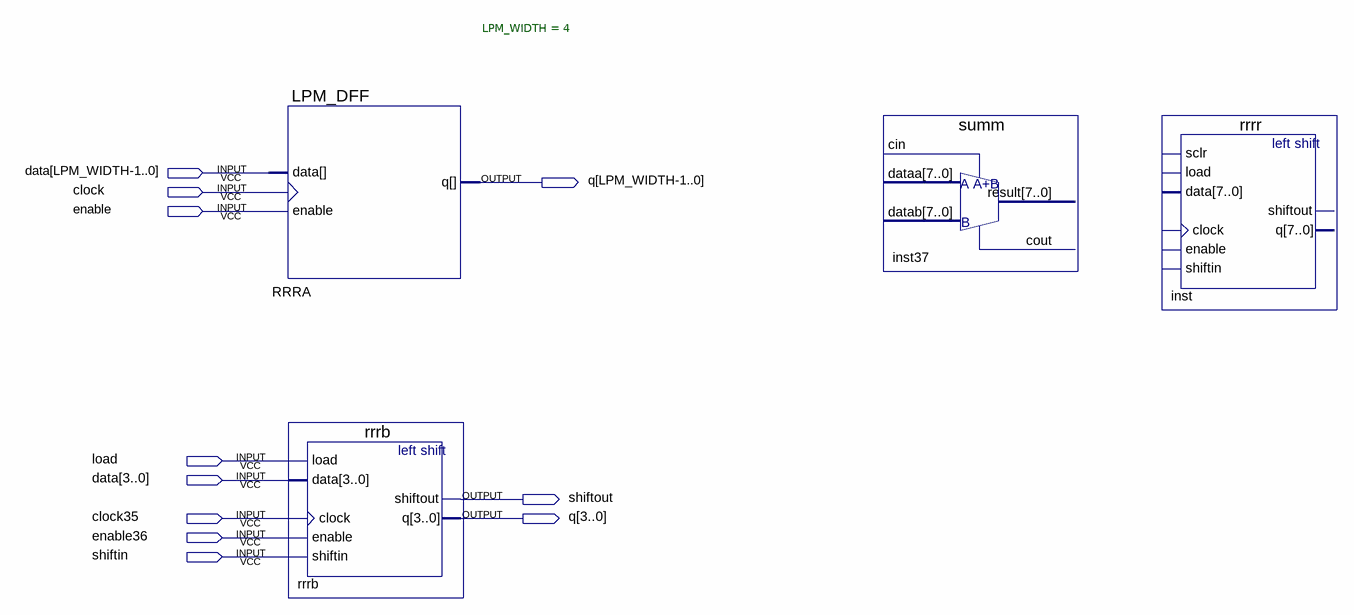
[diagram p0: schematic sheet]
// Quartus schematic First.bdf as structural Verilog: 4 symbols, 11 pins
module First (
  input  \data[LPM_WIDTH-1..0] ,
  input  clock,
  input  enable,
  input  load,
  input  [3:0] data,
  input  clock35,
  input  enable36,
  input  shiftin,
  output \q[LPM_WIDTH-1..0] ,
  output shiftout,
  output [3:0] q
);

  LPM_DFF #(.LPM_WIDTH(4)) RRRA (
    .clock(clock), .data({4{\data[LPM_WIDTH-1..0] }}), .enable(enable), .q(\q[LPM_WIDTH-1..0] ));
  rrrb rrrb (
    .load(load), .data(data), .clock(clock35), .enable(enable36), .shiftin(shiftin), .shiftout(shiftout),
    .q(q));
  summ inst37 ();  // open: cin, dataa, datab, result, cout
  rrrr inst ();  // open: sclr, load, data, clock, enable, shiftin, shiftout, q
endmodule
